# Altium schematic sheet output_driver.SchDoc: Fine Delay FMC
size 297 x 209 mm; CheckedBy: B. Civel; CompanyName: CERN; DrawnBy: TW, GK; Engineer: TW; Organization: CERN; Address1: European Organization for Nuclear Research; Address2: CH-1211 Geneve 23 - Switzerland; DocumentNumber: 9; Revision: -; SheetNumber: 9; SheetTotal: 10; ModifiedBy: B. Civel; CreateDate: 01/12/2011; CheckedDate: 06/06/2013; Title2: Output buffer/driver (all channels); DivGrp: BE-CO; Designer: TW, GK; EDA_Number: EDA-02267-V6-1; Projet: Fine Delay FMC (FMCDel1ns4cha); ModifiedDate: 16/08/2012
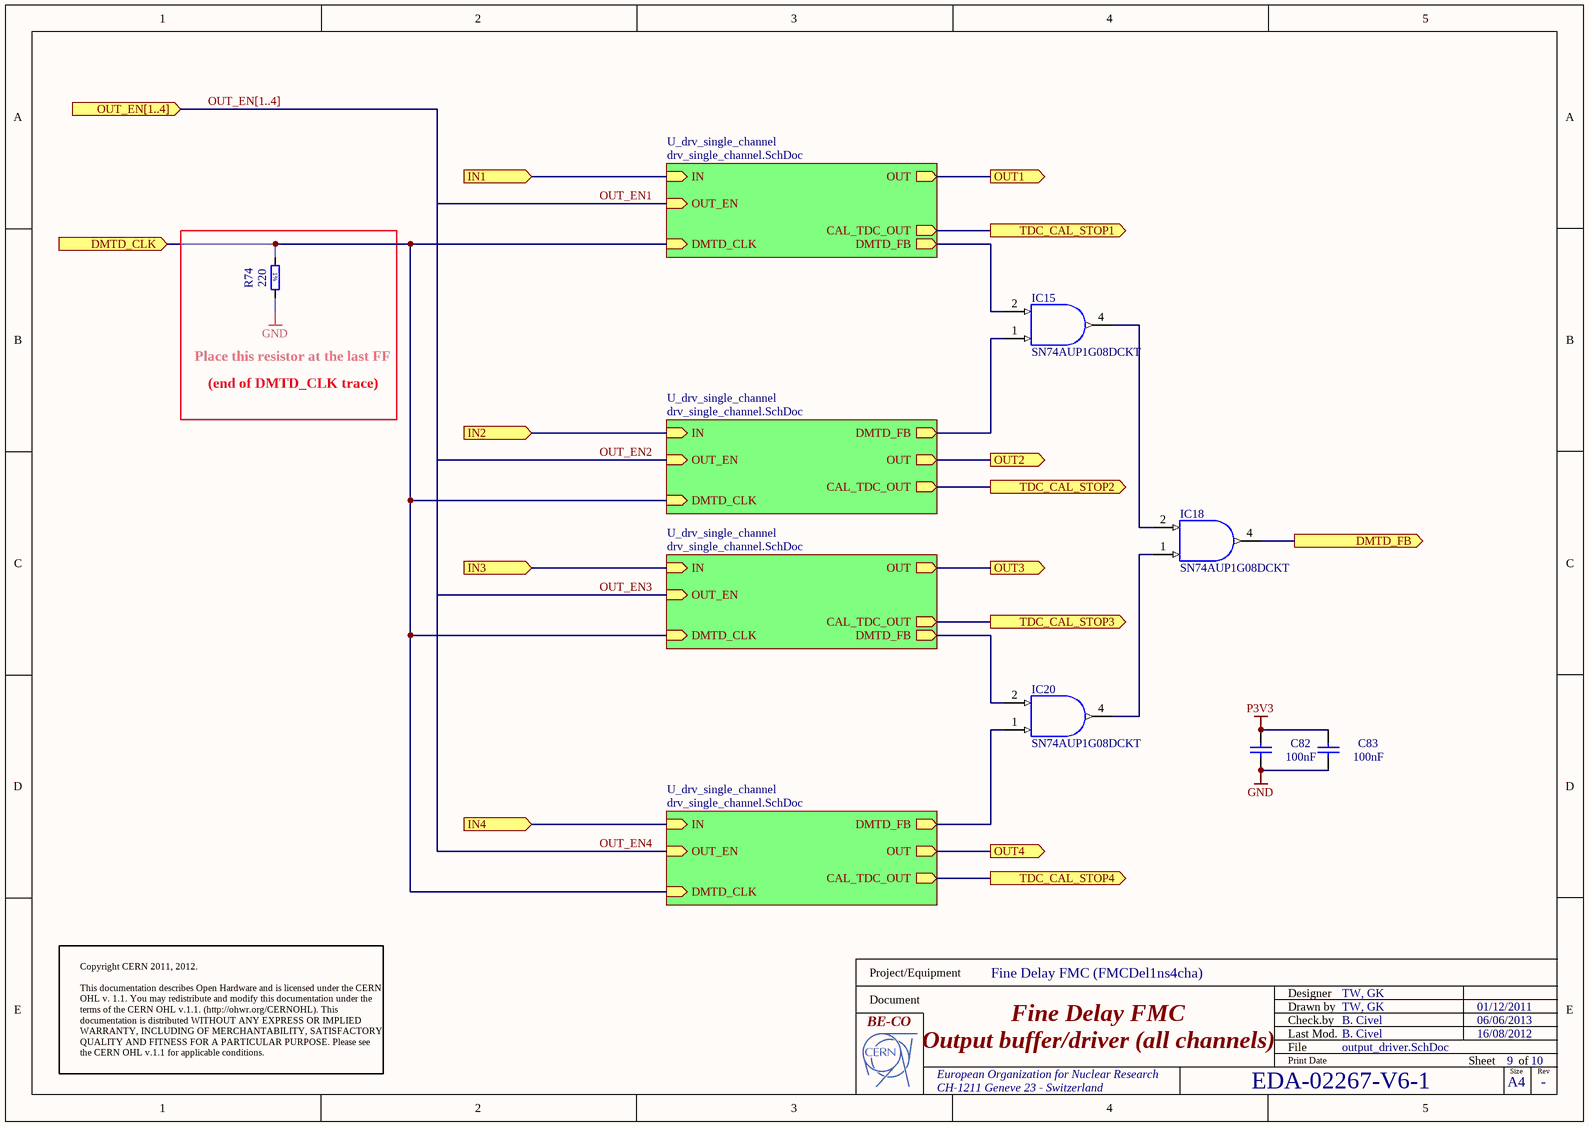
[diagram p0: output_driver.SchDoc]

## Parts
C82  100nF  [CAPC1608X87N]
C83  100nF  [CAPC1608X87N]
IC15  SN74AUP1G08DCKT  [SOT65P210X110-5N]
IC18  SN74AUP1G08DCKT  [SOT65P210X110-5N]
IC20  SN74AUP1G08DCKT  [SOT65P210X110-5N]
R74  220  [RESC1608X55N]

## Sub-sheets
U_drv_single_channel = drv_single_channel.SchDoc: IN (in), OUT (out), OUT_EN (in), CAL_TDC_OUT (out), DMTD_FB (out), DMTD_CLK (in)
U_drv_single_channel = drv_single_channel.SchDoc: IN (in), OUT (out), OUT_EN (in), CAL_TDC_OUT (out), DMTD_FB (out), DMTD_CLK (in)
U_drv_single_channel = drv_single_channel.SchDoc: IN (in), OUT (out), OUT_EN (in), CAL_TDC_OUT (out), DMTD_FB (out), DMTD_CLK (in)
U_drv_single_channel = drv_single_channel.SchDoc: IN (in), OUT (out), OUT_EN (in), CAL_TDC_OUT (out), DMTD_FB (out), DMTD_CLK (in)

## Ports
DMTD_CLK (in), DMTD_FB (out), IN1 (in), IN2 (in), IN3 (in), IN4 (in), OUT1 (out), OUT2 (out), OUT3 (out), OUT4 (out), OUT_EN[1..4] (in), TDC_CAL_STOP1 (out), TDC_CAL_STOP2 (out), TDC_CAL_STOP3 (out), TDC_CAL_STOP4 (out)

## Nets
GND: C82.2 C83.2 IC15.3(GND) IC18.3(GND) IC20.3(GND) R74.2
P3V3: C82.1 C83.1 IC15.5(VCC) IC18.5(VCC) IC20.5(VCC)
DMTD_CLK: R74.1 ; port DMTD_CLK, sheet U_drv_single_channel/DMTD_CLK, sheet U_drv_single_channel/DMTD_CLK, sheet U_drv_single_channel/DMTD_CLK, sheet U_drv_single_channel/DMTD_CLK
DMTD_FB: IC18.4(Y) ; port DMTD_FB
IN1: port IN1, sheet U_drv_single_channel/IN
IN2: port IN2, sheet U_drv_single_channel/IN
IN3: port IN3, sheet U_drv_single_channel/IN
IN4: port IN4, sheet U_drv_single_channel/IN
OUT1: port OUT1, sheet U_drv_single_channel/OUT
OUT2: port OUT2, sheet U_drv_single_channel/OUT
OUT3: port OUT3, sheet U_drv_single_channel/OUT
OUT4: port OUT4, sheet U_drv_single_channel/OUT
OUT_EN1: sheet U_drv_single_channel/OUT_EN
OUT_EN2: sheet U_drv_single_channel/OUT_EN
OUT_EN3: sheet U_drv_single_channel/OUT_EN
OUT_EN4: sheet U_drv_single_channel/OUT_EN
TDC_CAL_STOP1: port TDC_CAL_STOP1, sheet U_drv_single_channel/CAL_TDC_OUT
TDC_CAL_STOP2: port TDC_CAL_STOP2, sheet U_drv_single_channel/CAL_TDC_OUT
TDC_CAL_STOP3: port TDC_CAL_STOP3, sheet U_drv_single_channel/CAL_TDC_OUT
TDC_CAL_STOP4: port TDC_CAL_STOP4, sheet U_drv_single_channel/CAL_TDC_OUT
NetIC15_1: IC15.1(B) ; sheet U_drv_single_channel/DMTD_FB
NetIC15_2: IC15.2(A) ; sheet U_drv_single_channel/DMTD_FB
NetIC15_4: IC15.4(Y) IC18.2(A)
NetIC18_1: IC18.1(B) IC20.4(Y)
NetIC20_1: IC20.1(B) ; sheet U_drv_single_channel/DMTD_FB
NetIC20_2: IC20.2(A) ; sheet U_drv_single_channel/DMTD_FB

## Buses and harness runs
bus OUT_EN[1..4] = port OUT_EN[1..4]

## Notes on the sheet
- Place this resistor at the last FF
- (end of DMTD_CLK trace)
- Copyright CERN 2011, 2012.
  This documentation describes Open Hardware and is licensed under the CERN OHL v. 1.1. You may redistribute and modify this documentation under the terms of the CERN OHL v.1.1. (http://ohwr.org/CERNOHL). This documentation is distributed WITHOUT ANY EXPRESS OR IMPLIED WARRANTY, INCLUDING OF MERCHANTABILITY, SATISFACTORY QUALITY AND FITNESS FOR A PARTICULAR PURPOSE. Please see the CERN OHL v.1.1 for applicable conditions.
- Project/Equipment
- Document
- Designer
- Drawn by
- Check.by
- File
- Last Mod.
- Print Date
- Sheet
- Size
- A4
- of
- Rev
- (in symbol R0603_220R_1%_0.1W_100PPM) 1%

## Library data of the parts
C82 C83 = CC0603_100NF_50V_10%_X7R: Non-polarised capacitor; Part Description: SMD Multilayer Chip Ceramic Capacitor; Manufacturer: GENERIC; Manufacturer1 Part Number: 223858615649; Voltage: 50V; TC: X7R; Tolerance: ±10%; Table: Capacitors SMD; Part Number: CC0603_100NF_50V_10%_X7R; Component Kind: Standard; Component Type: Standard; Pin Count: 2; Value: 100nF; Status: Preferred; Manufacturer Part Number: CC0603_100NF_50V_10%_X7R; Case: 0603; Mounted: Yes; Socket: No; SMD: Yes; Manufacturer1 Example: PHYCOMP; Manufacturer1 ComponentHeight: 0.87mm; HelpURL: \\cern.ch\dfs\Applications\Altium\Datasheets\CC0603_X7R_PHYCOMP.pdf; Author: CERN DEM JLC; CreateDate: 03/12/2007; LatestRevisionDate: 03/12/2007
IC15 IC18 IC20 = SN74AUP1G08DCKT: Single 2-Input AND Gate; Part Description: Low-Power Single 2-Input AND Gate; Manufacturer: TEXAS INSTRUMENTS; Table: Standard Logic; PressFit: No; Bonding: No; Part Number: SN74AUP1G08DCKT; Component Kind: Standard; Component Type: Standard; Device: SN74AUP1G08DCKT; PackageDescription: SOT353, SC70-5, SOT, 0.65mm Pitch, 5 pin, 1.25mm W X 2.00mm L X 1.10mm H, IPC Medium Density; Manufacturer Part Number: SN74AUP1G08DCKT; Pin Count: 5; Case: SOT353; Mounted: Yes; Socket: No; SMD: Yes; ComponentHeight: 1.1mm; Author: CERN DEM JLC; HelpURL: \\cern.ch\dfs\Applications\Altium\Datasheets\SN74AUP1G08DCKT.pdf; CreateDate: 19/12/2011; LatestRevisionDate: 19/12/2011
R74 = R0603_220R_1%_0.1W_100PPM: Resistor - 1%; Part Description: General Purpose Thick Film Chip Resistor; Manufacturer: GENERIC; Manufacturer1 Part Number: NRC06F2200TRF; Power: 0.1W; TC: ±100ppm/°C; Table: Resistors SMD; Part Number: R0603_220R_1%_0.1W_100PPM; Component Kind: Standard; Component Type: Standard; Pin Count: 2; Value: 220; Status: Preferred; Tolerance: ±1%; Manufacturer Part Number: R0603_220R_1%_0.1W_100PPM; Case: 0603; Mounted: Yes; Socket: No; SMD: Yes; Manufacturer1 Example: NIC COMPONENT; Manufacturer1 ComponentHeight: 0.55mm; HelpURL: \\cern.ch\dfs\Applications\Altium\Datasheets\R0603_NIC_NRC.pdf; Author: CERN DEM JLC; CreateDate: 12/3/2007; LatestRevisionDate: 3/13/2008